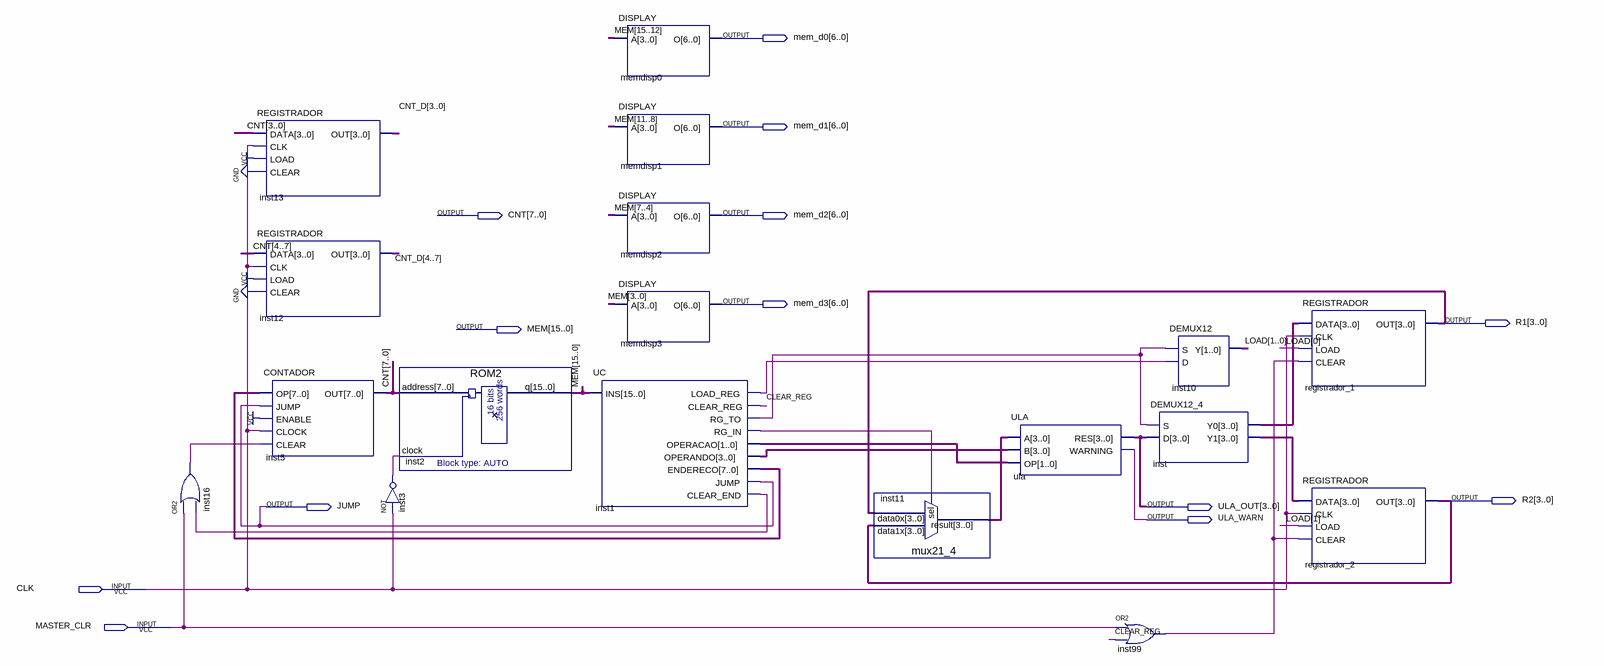
[diagram p0: schematic sheet]
// Quartus schematic PRINCIPAL2_TESTE.bdf as structural Verilog: 18 symbols, 13 pins
module PRINCIPAL2_TESTE (
  input  CLK,
  input  MASTER_CLR,
  output [6:0] mem_d0,
  output [6:0] mem_d1,
  output [7:0] CNT,
  output [6:0] mem_d2,
  output [6:0] mem_d3,
  output [3:0] R1,
  output [15:0] MEM,
  output [3:0] R2,
  output JUMP,
  output [3:0] ULA_OUT,
  output ULA_WARN
);

  wire CLEAR_REG, inst1_clear_end, inst1_load_reg, inst1_rg_in, inst1_rg_to, inst3_out, inst16_out,
       inst99_out;
  wire [1:0] inst1_operacao, LOAD;
  wire [3:0] inst1_operando, inst11_result, inst_y0, inst_y1;
  wire [7:0] CNT_D, inst1_endereco;

  or inst16 (inst16_out, MASTER_CLR, inst1_clear_end);
  REGISTRADOR inst13 (.DATA(CNT[3:0]), .CLK(CLK), .LOAD(1'b1), .CLEAR(1'b0), .OUT(CNT_D[3:0]));
  REGISTRADOR inst12 (
    .DATA({CNT[4], CNT[5], CNT[6], CNT[7]}), .CLK(CLK), .LOAD(1'b1), .CLEAR(1'b0),
    .OUT({CNT_D[4], CNT_D[5], CNT_D[6], CNT_D[7]}));
  CONTADOR inst5 (.OP(inst1_endereco), .JUMP(JUMP), .ENABLE(1'b1), .CLOCK(CLK), .CLEAR(inst16_out), .OUT(CNT));
  not inst3 (inst3_out, CLK);
  ROM2 inst2 (.address(CNT), .clock(inst3_out), .q(MEM));
  DISPLAY memdisp0 (.A(MEM[15:12]), .O(mem_d0));
  DISPLAY memdisp1 (.A(MEM[11:8]), .O(mem_d1));
  DISPLAY memdisp2 (.A(MEM[7:4]), .O(mem_d2));
  DISPLAY memdisp3 (.A(MEM[3:0]), .O(mem_d3));
  UC inst1 (
    .INS(MEM), .LOAD_REG(inst1_load_reg), .CLEAR_REG(CLEAR_REG), .RG_TO(inst1_rg_to), .RG_IN(inst1_rg_in),
    .OPERACAO(inst1_operacao), .OPERANDO(inst1_operando), .ENDERECO(inst1_endereco), .JUMP(JUMP),
    .CLEAR_END(inst1_clear_end));
  mux21_4 inst11 (.data1x(R2), .data0x(R1), .sel(inst1_rg_in), .result(inst11_result));
  ULA ula (.A(inst11_result), .B(inst1_operando), .OP(inst1_operacao), .RES(ULA_OUT), .WARNING(ULA_WARN));
  or inst99 (inst99_out, MASTER_CLR, CLEAR_REG);
  DEMUX12 inst10 (.S(inst1_rg_to), .D(inst1_load_reg), .Y(LOAD));
  DEMUX12_4 inst (.S(inst1_rg_to), .D(ULA_OUT), .Y0(inst_y0), .Y1(inst_y1));
  REGISTRADOR registrador_1 (.DATA(inst_y0), .CLK(CLK), .LOAD(LOAD[0]), .CLEAR(inst99_out), .OUT(R1));
  REGISTRADOR registrador_2 (.DATA(inst_y1), .CLK(CLK), .LOAD(LOAD[1]), .CLEAR(inst99_out), .OUT(R2));
endmodule
